# EAGLE design openSX70-dongle-USB-V2-1 (EAGLE 9.2.0)
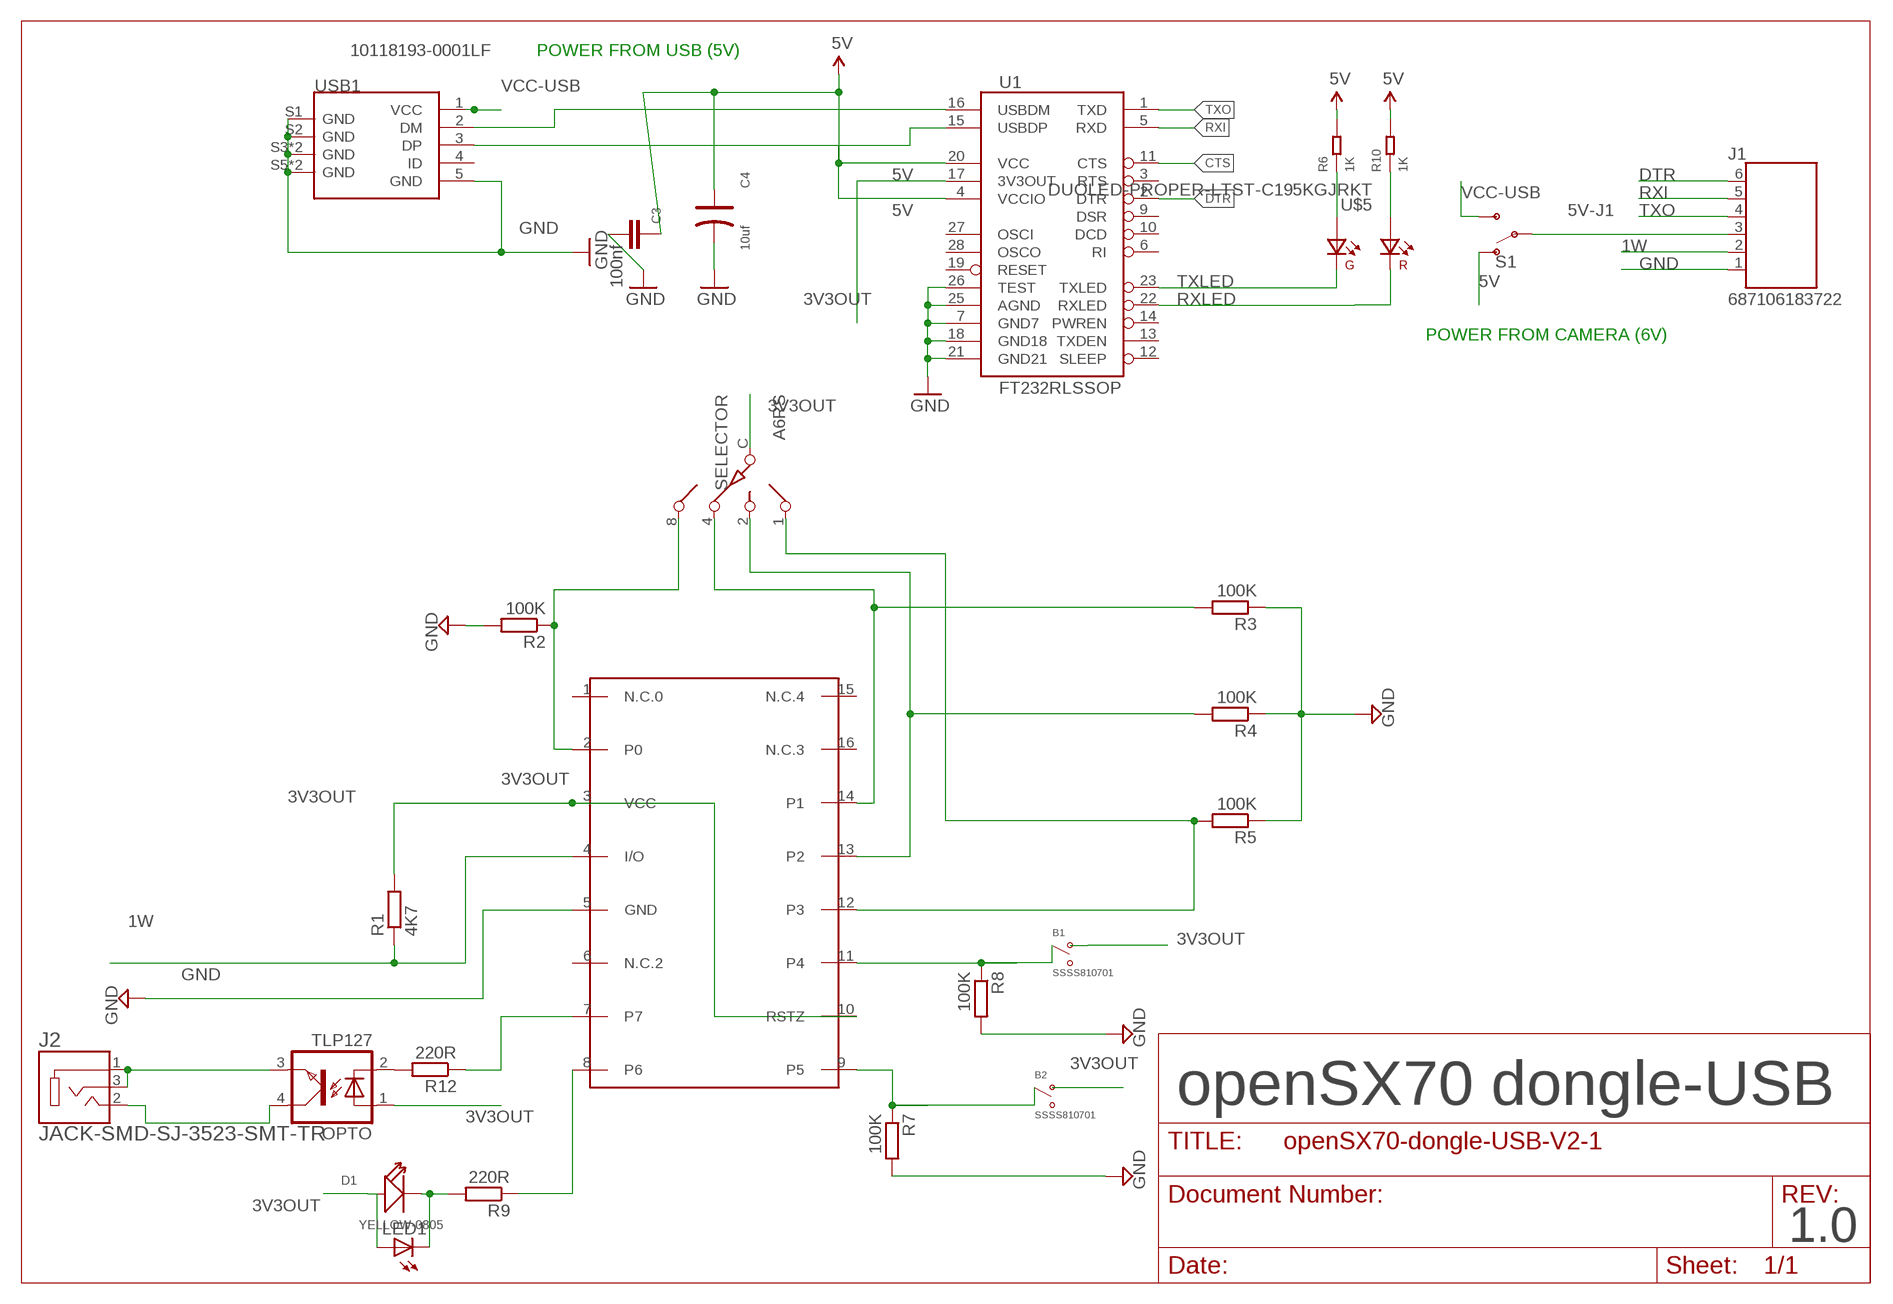
[diagram p0: schematic, sheet 1]

## Parts
B1  SSSS810701  [SSSS810701]
B2  SSSS810701  [SSSS810701]
C3  100nf  C-EUC0603  [C0603]
C4  10uf  TANTALUM-SMD-10UF-16V-10%(AVX-A)  [AVX-A]
D1  YELLOW-0805  SMD-LED-CLEAR-YELLOW(0805)  [LED-0805]
DS2408  DS2408  [SO16]
J1  687106183722  [687106183722]
J2  JACK-SMD-SJ-3523-SMT-TR  [CUI_SJ-3523-SMT-TR]
LED1  LED3MM  [LED3MM]
OPTO  TLP127  [SO-4]
R1  4K7  R-EU_R0603  [R0603]
R2  100K  R-EU_R0603  [R0603]
R3  100K  R-EU_R0603  [R0603]
R4  100K  R-EU_R0603  [R0603]
R5  100K  R-EU_R0603  [R0603]
R6  1K  SMD-RES-1K-1%-1/10W(0603)  [R0603]
R7  100K  R-EU_R0603  [R0603]
R8  100K  R-EU_R0603  [R0603]
R9  220R  R-EU_R0603  [R0603]
R10  1K  SMD-RES-1K-1%-1/10W(0603)  [R0603]
R12  220R  R-EU_R0603  [R0603]
S1  SWITCH-SPDT-SMD-RIGHT-ANGLE  [SWITCH_SPST_SMD_A]
SELECTOR  A6RS  [A6RS-161RS]
U1  FT232RLSSOP  [SSOP28DB]
U$5  DUOLED-PROPER-LTST-C195KGJRKT  [LTST-BILED-15X16]
USB1  10118193-0001LF  MICRO-USB-SMD-B-(10118193-0001LF)  [MICRO-USB5+6P-SMD-0.65-B]

## Nets
1W: DS2408.4(I/O) J1.2 R1.1
3V3OUT: B1.3(A) B2.3(A) D1.+ DS2408.3(VCC) DS2408.10(RSTZ) LED1.A OPTO.1(A) R1.2 SELECTOR.C U1.17(3V3OUT)
5V: C3.1 C4.+ R6.2 R10.2 S1.1(O) U1.4(VCCIO) U1.20(VCC)
5V-J1: J1.3 S1.2(P)
CTS: U1.11(CTS)
DTR: J1.6 U1.2(DTR)
GND: C3.2 C4.- DS2408.5(GND) J1.1 R2.2 R3.1 R4.1 R5.1 R7.2 R8.2 U1.7(GND7) U1.18(GND18) U1.21(GND21) U1.25(AGND) U1.26(TEST) USB1.5(GND) USB1.S1(GND) USB1.S2(GND) USB1.S3(GND) USB1.S4(GND) USB1.S5(GND) USB1.S6(GND)
N$1: J2.1 J2.3 OPTO.3(EMIT)
N$2: D1.- LED1.K(C) R9.2
N$3: DS2408.2(P0) R2.1 SELECTOR.8
N$4: DS2408.14(P1) R3.2 SELECTOR.4
N$5: DS2408.13(P2) R4.2 SELECTOR.2
N$6: B1.2(COM) DS2408.11(P4) R8.1
N$7: B2.2(COM) DS2408.9(P5) R7.1
N$8: DS2408.8(P6) R9.1
N$9: R10.1 U$5.P$2(A2)
N$10: OPTO.2(C) R12.2
N$11: DS2408.7 R12.1
N$12: J2.2 OPTO.4(COL)
N$13: DS2408.12(P3) R5.2 SELECTOR.1
N$14: R6.1 U$5.P$1(A1)
N$16: U1.16(USBDM) USB1.2(DM)
RXI: J1.5 U1.5(RXD)
RXLED: U1.22(RXLED) U$5.P$4(K2)
TXLED: U1.23(TXLED) U$5.P$3(K1)
TXO: J1.4 U1.1(TXD)
USB_D+: U1.15(USBDP) USB1.3(DP)
VCC-USB: S1.3(S) USB1.1(VCC)
Unconnected: B1.1(B) B2.1(B) DS2408.1(N.C.0) DS2408.6(N.C.2) DS2408.15(N.C.4) DS2408.16(N.C.3) U1.3(RTS) U1.6(RI) U1.9(DSR) U1.10(DCD) U1.12(SLEEP) U1.13(TXDEN) U1.14(PWREN) U1.19(RESET) U1.27(OSCI) U1.28(OSCO) USB1.4(ID)

## Notes on the sheet
- POWER FROM USB (5V)
- POWER FROM CAMERA (6V)
- openSX70 dongle-USB
- 1.0

## Library data of the parts
B1 B2 = _openSX70:SSSS810701; AVAILABILITY: Good; DESCRIPTION: Slide Switch • Rating (max.): 0.3 A 5 VDC • Poles: 1 • Positions: 2 • Travel : 1.5 mm • Operating direction: Horizontal; MF: ALPS; MP: SSSS810701; PACKAGE: None; PRICE: 0.53 USD
C3 = resistor:C-EU: CAPACITOR, European symbol
C4 = Seeed-Capacitor-2016:TANTALUM-SMD-10UF-16V-10%(AVX-A): 302020002; MPN: TAJA106K016RNJ
D1 = Seeed-LED-2016:SMD-LED-CLEAR-YELLOW(0805): 304090039; MPN: 17-215UYC/S530-A3/TR8
DS2408 = _openSX70:DS2408
J1 = openSX70_PATHFINDER_V5.5-SEEED_20180522:687106183722: 687106183722 WR-FPC 0.50mm SMT Horizontal Bottom Contact - Low Profile <http://katalog.we-online.de/media/images/v2/Family_WR-FPC_6871xx183722.jpg> Details see: http://katalog.we-online.de/en/em/FPC_0_5_SMT_ZIF_HORIZONTAL_BOTTOM_CONTACT_LOW_PROFILE_6871xx183722 Created by Yingchun,shan 2016 (C) Wurth Elektronik; AVAILABILITY: Good; DESCRIPTION: CONN FFC BTM 6POS 0.5MM SMD R/A; MF: Wurth Electronics; MP: 687106183722; PACKAGE: None; PRICE: 1.21 USD
J2 = _openSX70:JACK-SMD-SJ-3523-SMT-TR: Audio Jack Connector 3.5 mm Low Profile Surface Mount Stereo Jack, 3 Pin Right-Angle; AVAILABILITY: Unavailable; CUI_PURCHASE_URL: https://www.cui.com/product/interconnect/audio-connectors/3.5-mm-jacks/sj-352x-smt-series?utm_source=snapeda.com&utm_medium=referral&utm_campaign=snapedaBOM; DESCRIPTION: SJ Series 3.5 mm 12 V SMT Right Angle Stereo Audio Jack; MF: CUI Inc.; MP: SJ-3523-SMT-TR; PACKAGE: LGA-10 STMicroelectronics; PRICE: None
LED1 = openSX70_PATHFINDER_V5.5-SEEED_20180522:LED: LED OSRAM: - CHIPLED LG R971, LG N971, LY N971, LG Q971, LY Q971, LO R971, LY R971 LH N974, LH R974 LS Q976, LO Q976, LY Q976 LO Q996 - Hyper CHIPLED LW Q18S LB Q993, LB Q99A, LB R99A - SideLED LS A670, LO A670, LY A670, LG A670, LP A670 LB A673, LV A673, LT A673, LW A673 LH A674 LY A675 LS A676, LA A676, LO A676, LY A676, LW A676 LS A679, LY A679, LG A679 - Hyper Micro SIDELED® LS Y876, LA Y876, LO Y876, LY Y876 LT Y87S - SmartLED LW L88C, LW L88S LB L89C, LB L89S, LG L890 LS L89K, LO L89K, LY L89K LS L896, LA L896, LO L896, LY L896 - TOPLED LS T670, LO T670, LY T670, LG T670, LP T670 LSG T670, LSP T670, LSY T670, LOP T670, LYG T670 LG T671, LOG T671, LSG T671 LB T673, LV T673, LT T673, LW T673 LH T674 LS T676, LA T676, LO T676, LY T676, LB T676, LH T676, LSB T676, LW T676 LB T67C, LV T67C, LT T67C, LS T67K, LO T67K, LY T67K, LW E67C LS E67B, LA E67B, LO E67B, LY E67B, LB E67C, LV E67C, LT E67C LW T67C LS T679, LY T679, LG T679 LS T770, LO T770, LY T770, LG T770, LP T770 LB T773, LV T773, LT T773, LW T773 LH T774 LS E675, LA E675, LY E675, LS T675 LS T776, LA T776, LO T776, LY T776, LB T776 LHGB T686 LT T68C, LB T68C - Hyper Mini TOPLED® LB M676 - Mini TOPLED Santana® LG M470 LS M47K, LO M47K, LY M47K Source: http://www.osram.convergy.de LUXEON: - LUMILED® LXK2-PW12-R00, LXK2-PW12-S00, LXK2-PW14-U00, LXK2-PW14-V00 LXK2-PM12-R00, LXK2-PM12-S00, LXK2-PM14-U00 LXK2-PE12-Q00, LXK2-PE12-R00, LXK2-PE12-S00, LXK2-PE14-T00, LXK2-PE14-U00 LXK2-PB12-K00, LXK2-PB12-L00, LXK2-PB12-M00, LXK2-PB14-N00, LXK2-PB14-P00, LXK2-PB14-Q00 LXK2-PR12-L00, LXK2-PR12-M00, LXK2-PR14-Q00, LXK2-PR14-R00 LXK2-PD12-Q00, LXK2-PD12-R00, LXK2-PD12-S00 LXK2-PH12-R00, LXK2-PH12-S00 LXK2-PL12-P00, LXK2-PL12-Q00, LXK2-PL12-R00 Source: www.luxeon.com KINGBRIGHT: KA-3528ASYC Source: www.kingbright.com
OPTO = openSX70:TLP127
R1-R5 R7-R9 R12 = resistor:R-EU_: RESISTOR, European symbol
R6 R10 = openSX70_PATHFINDER_V5.5-SEEED_20180522:SMD-RES-1K-1%-1/10W(0603): 301010298; MPN: RC0603FR-071KL
S1 = SparkFun-Switches:SWITCH-SPDT: Single Pole, Double Throw (SPDT) Switch Single-pole, double-throw (SPDT) switch. Variant Overview SMD-AYZ0202 Surface Mount DPDT Switch <https://www.sparkfun.com/products/597> (COM-00597) Used on e.g. LilyPad Arduino USB - ATmega32U4 Board <https://www.sparkfun.com/products/12049> PTH-11.6X4.0MM SPDT Mini Power Switch <https://www.sparkfun.com/products/102> (COM-00102) Used on e.g. SparkFun Simon Says - Through-Hole Soldering Kit <https://www.sparkfun.com/products/10547> (KIT-10547) PTH-11.6X4.0MM-KIT KIT version of SPDT Mini Power Switch - Simplifies soldering by removing tStop of switch pins - only one side can be soldered. PTH-11.6X4.0MM-LOCK LOCK version of SPDT Mini Power Switch - Offset pins hold switch in place for easier soldering. SMD-RIGHT-ANGLE Surface Mount Right Angle Switch <https://www.sparkfun.com/products/10860> (COM-10860) Used on e.g. SparkFun ESP8266 Thing <https://www.sparkfun.com/products/13231>; PROD_ID: SWCH-10651; SF_SKU: COM-10860
SELECTOR = _openSX70:A6RS
U1 = SparkFun:FT232RL: USB UART FT232RL 4th Generation USB UART (USB <-> Serial) Controller. Spark Fun Electronics SKU : COM-00650
U$5 = _openSX70:DUOLED-PROPER-LTST-C195KGJRKT; AVAILABILITY: Unavailable; DESCRIPTION: Green/Red 130° Water Clear 35/25 mcd 2 V 0605 Surface Mount Bi-Color LED; MF: Lite-On Inc.; MP: LTST-C195KGJRKT; PACKAGE: 0606 Lite-On; PRICE: None
USB1 = Seeed-Connector -2016:MICRO-USB-SMD-B-(10118193-0001LF): 320010003; MPN: 10118193-0001LF

## Net classes
0 GND: width 0.203 mm
1 power: width 0.203 mm
2 2.8V: width 0.203 mm

## Board
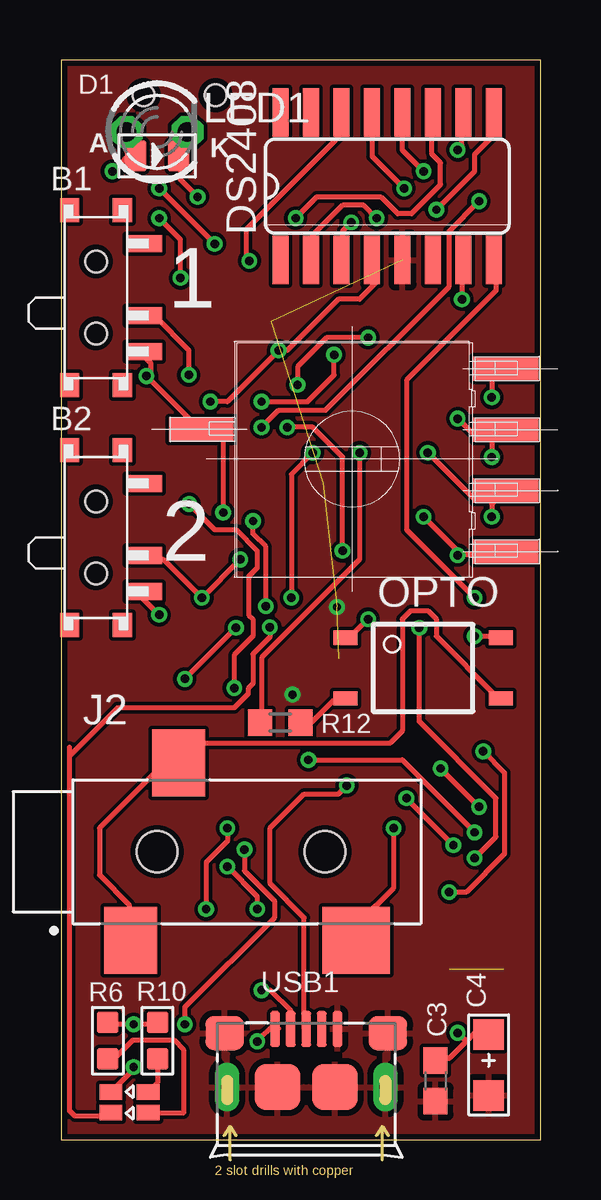
[diagram p1: board, top side]
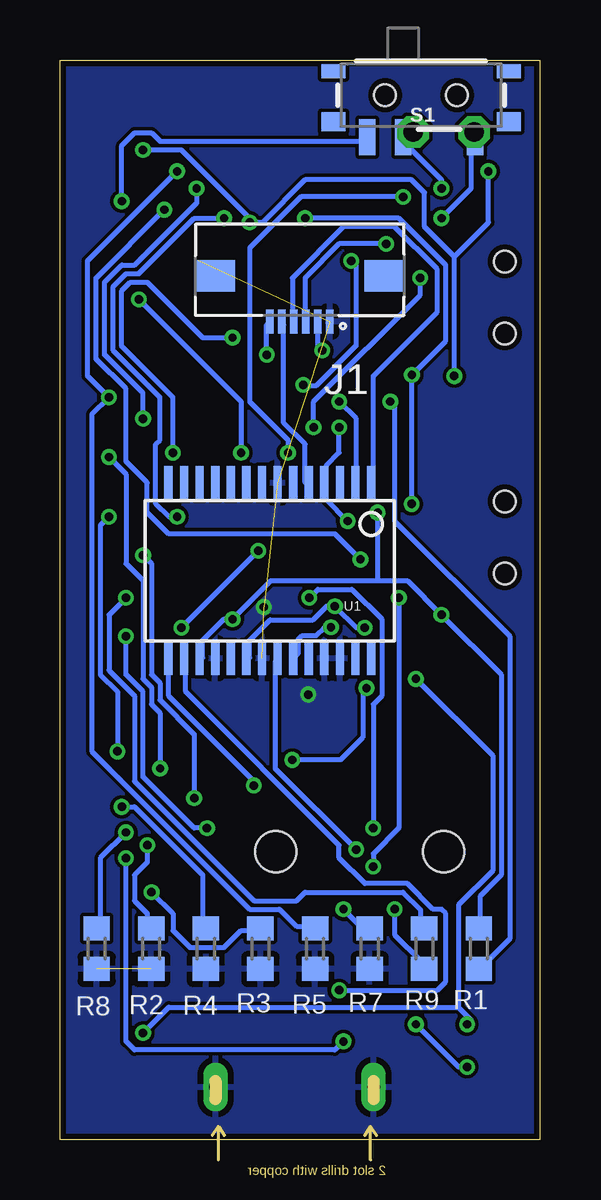
[diagram p2: board, bottom side, seen from below]

Size 20 x 45 mm. Coordinates in mm from the lower left corner, seen from the top.
Outline: 0,0 20,0 20,45 0,45 0,0
Copper layers (1*16): Top 0.035mm / dielectric 1.5mm / Bottom 0.035mm
Design rules "SeeedStudio_2layer_DRU_no_angle_20140221": minimum track width 6mil, minimum drill 12mil, track to track 6mil, track to pad 6mil, pad to pad 6mil, via to via 6mil, smd to smd 0mil, copper to edge 10mil, drill to drill 10mil, minimum pad ring 10mil, minimum via ring 6mil, stop-mask expansion 2mil, vias tented up to drill 100mil, thermal gap 10mil

### Footprints (pad centres in the part's own frame; a part is rotated, then mirrored left to right if it is on the bottom)
SSSS810701 = smd 0.7 x 1.5: 1 -2.25,2; 2 0.75,2; 3 2.25,2 | smd 1 x 0.8: 4.1 -3.65,1.1; 4.2 3.65,1.1; 4.3 -3.65,-1.1; 4.4 3.65,-1.1 | hole 0.9: 1.5,0; -1.5,0
C0603 = smd 1.1 x 1: 1 -0.85,0; 2 0.85,0
AVX-A = smd 1.27 x 1.27: + -1.27,0; - 1.27,0
LED-0805 = smd 0.889 x 1.27: + -0.889,0; - 0.889,0
SO16 = smd 0.66 x 2.032: 1 -4.445,-3.073; 2 -3.175,-3.073; 3 -1.905,-3.073; 4 -0.635,-3.073; 5 0.635,-3.073; 6 1.905,-3.073; 7 3.175,-3.073; 8 4.445,-3.073; 9 4.445,3.073; 10 3.175,3.073; 11 1.905,3.073; 12 0.635,3.073; 13 -0.635,3.073; 14 -1.905,3.073; 15 -3.175,3.073; 16 -4.445,3.073
687106183722 = smd 0.3 x 1: 1 -1.25,1.9; 2 -0.75,1.9; 3 -0.25,1.9; 4 0.25,1.9; 5 0.75,1.9; 6 1.25,1.9 | smd 1.65 x 1.3: Z1 -3.525,0; Z2 3.525,0
CUI_SJ-3523-SMT-TR = smd 2.2 x 2.8: 1 -1.1,-3.7; 3 0.9,3.7 | smd 2.8 x 2.8: 2 8.3,-3.7 | hole 1.7: 0,0; 7,0
LED3MM = drill 0.813 octagon: A -1.27,0; K 1.27,0
SO-4 = smd 1 x 0.6: 1 -3.24,0.635; 2 -3.24,-1.905; 3 3.24,-1.905; 4 3.24,0.635
R0603 = smd 1 x 1.1: 1 -0.85,0; 2 0.85,0
R0603' = smd 0.889 x 0.889: 1 0,0.762; 2 0,-0.762
SWITCH_SPST_SMD_A = smd 0.7 x 1.5: 1 -2.25,-1.75; 2 -0.75,-1.75; 3 2.25,-1.75 | smd 1 x 0.6: GND1 -3.65,1; GND3 3.65,1 | smd 1 x 0.8: GND2 -3.65,-1.1; GND4 3.65,-1.1 | hole 0.9: -1.5,0; 1.5,0
A6RS-161RS = smd 1 x 2.7: 1 8.89,-1.397; 2 6.35,-1.397; 4 3.81,-1.397; 8 1.27,-1.397; C 6.35,11.303
SSOP28DB = smd 0.348 x 1.397: 1 -4.225,-3.656; 2 -3.575,-3.656; 3 -2.925,-3.656; 4 -2.275,-3.656; 5 -1.625,-3.656; 6 -0.975,-3.656; 7 -0.325,-3.656; 8 0.325,-3.656; 9 0.975,-3.656; 10 1.625,-3.656; 11 2.275,-3.656; 12 2.925,-3.656; 13 3.575,-3.656; 14 4.225,-3.656; 15 4.225,3.656; 16 3.575,3.656; 17 2.925,3.656; 18 2.275,3.656; 19 1.625,3.656; 20 0.975,3.656; 21 0.325,3.656; 22 -0.325,3.656; 23 -0.975,3.656; 24 -1.625,3.656; 25 -2.275,3.656; 26 -2.925,3.656; 27 -3.575,3.656; 28 -4.225,3.656
LTST-BILED-15X16 = smd 0.65 x 0.952: P$1 0.425,0.776; P$2 -0.425,0.776; P$3 0.425,-0.776; P$4 -0.425,-0.776
MICRO-USB5+6P-SMD-0.65-B = smd 0.4 x 1.5: 1 -1.3,-0.25; 2 -0.65,-0.25; 3 0,-0.25; 4 0.65,-0.25; 5 1.3,-0.25 | smd 1.6 x 1.4: S1 -3.4,-0.427; S6 3.4,-0.427 | drill 0.508 pad 1.016 long: S2 -3.3,-2.675; S5 3.3,-2.675 | smd 1.9 x 1.9: S3 -1.2,-2.675; S4 1.2,-2.675

### Placement (x,y rotation side)
B1  1.45,35.1 270 top
B2  1.45,25.1 270 top
C3  15.61,2.45 270 top
C4  17.83,3.11 270 top
D1  4,41 0 top
DS2408  13.6,39.74 0 top
J1  10,36 180 bottom
J2  4,12 0 top
LED1  4,42 0 top
OPTO  15.09,20.29 0 top
R1  2.53,7.96 90 bottom
R2  16.19,7.96 270 bottom
R3  11.64,7.96 90 bottom
R4  13.92,7.96 90 bottom
R5  9.36,7.96 90 bottom
R6  1K  [R0603']  1.94,4.12 180 top
R7  7.08,7.96 270 bottom
R8  18.47,7.96 270 bottom
R9  4.81,7.96 270 bottom
R10  1K  [R0603']  4.02,4.12 180 top
R12  9.14,17.38 0 top
S1  4.94,43.53 0 bottom
SELECTOR  17.15,23.24 90 top
U1  11.25,23.71 180 bottom
U$5  2.85,1.55 270 top
USB1  10.22,4.86 0 top

### Tracks (layer width: path | path; a pad name or v marks a point on that pad's centre or on a via)
1W  (via drill 0.35)
  Top 0.203: DS2408.4 12.98,36.63 13.16,36.45 13.16,35.74 12.45,35.03 11.56,35.03 9.42,32.89 v9.07,32.89 6.93,30.76 v6.22,30.76
  Bottom 0.203: v9.07,32.89 9.25,33.07 9.25,33.96 J1.2 | v6.22,30.76 6.04,30.58 6.04,25.78 1.25,20.98 1.25,8.36 2.49,7.11 R1.1
3V3OUT  (via drill 0.35)
  Top 0.203: v12.8,21.69 12.09,20.98 11.91,20.98 OPTO.1 | v4.09,21.87 3.38,22.58 3.38,22.76 B2.3 | 3.02,40.89 2.67,40.89 v2.13,40.36 | 3.02,40.89 D1.+ | v12.09,38.23 11.73,37.87 11.73,36.8 DS2408.3 | v16.54,41.25 16.71,41.43 16.71,42.67 DS2408.10 | v6.76,26.14 6.76,29.16 6.4,29.52 5.87,29.52 SELECTOR.C 5.69,29.69 v3.56,31.83 3.73,32 3.73,32.36 3.38,32.72 B1.3 | LED1.A 2.73,41.19 3.02,40.89
  Bottom 0.203: U1.17 14.05,20.09 14.05,20.8 13.16,21.69 v12.8,21.69 11.2,23.29 6.76,23.29 | 6.76,23.29 5.51,23.29 v4.09,21.87 1.6,19.38 1.6,11.02 2.49,10.13 2.49,8.89 R1.2 | v2.13,40.36 2.13,38.23 3.56,36.8 | v3.56,31.83 3.56,36.8 | 11.91,38.23 11.56,38.23 9.78,40.01 5.33,40.01 4.8,39.47 4.8,38.05 3.56,36.8 | v16.54,41.25 14.94,41.25 11.91,38.23 | 11.91,38.23 v12.09,38.23 | v6.76,26.14 6.76,23.29
5V  (via drill 0.35)
  Top 0.203: R6.2 1.96,4.8 v3.02,4.8 3.91,4.8 R10.2 | 16.89,4.09 17.25,4.45 17.78,4.45 C4.+ | 16.89,4.09 16.18,3.38 15.65,3.38 C3.1 | 16.89,4.09 v16.54,4.45 | v8,25.78 8,25.25 8.53,24.71 v8.53,22.23 | v17.42,39.12 16.18,37.87 16.18,35.56 11.02,30.4 9.07,30.4 v8.36,29.69 | v7.29,21.34 v5.16,19.2
  Bottom 0.203: v3.02,4.8 2.85,4.8 2.85,4.98 3.38,5.51 | 3.38,5.51 15.47,5.51 v16.54,4.45 | v8,25.78 8.89,26.67 8.89,27.2 U1.4 8.89,27.38 8.89,28.09 8.36,28.63 v8.36,29.69 | U1.20 12.09,20.09 12.09,20.8 11.23,21.66 9.46,21.66 8.89,22.23 v8.53,22.23 7.64,21.34 v7.29,21.34 | v17.42,39.12 17.42,41.43 16.89,41.96 16.18,41.96 15.82,41.6 7.29,41.6 S1.1 | 3.38,5.51 3.38,9.78 1.96,11.2 1.96,16 v5.16,19.2
5V-J1  (via drill 0.35)
  Top 0.203: v4.09,39.65 v6.4,37.34
  Bottom 0.203: v6.4,37.34 8.36,37.34 9.78,35.92 9.78,34.14 J1.3 | v4.09,39.65 4.09,40.01 5.69,41.6 S1.2
DTR  (via drill 0.35)
  Top 0.203: v11.38,32.72 11.38,31.86 10.27,30.76 v8.36,30.76
  Bottom 0.203: v11.38,32.72 11.38,33.96 J1.6 | v8.36,30.76 7.64,30.05 7.64,27.38 U1.2
GND  (via drill 0.35)  (5 unrouted)
  other vias: 9.65,18.55 11.5,22.2
  pour Top: 0,45 20,45 20,0 0,0
  pour Bottom: 0,45 20,45 20,0 0,0
N$1
  Top 0.203: OPTO.3 18.31,18.49 18.14,18.49 15.65,20.98 15.65,21.69 15.29,22.05 14.58,22.05 14.23,21.7 14.23,17.03 13.73,16.54 5.69,16.54 4.98,15.82 J2.3 4.8,15.65 4.27,15.65 1.6,12.98 1.6,11.02 2.85,9.78 2.85,8.36 J2.1
N$2  (via drill 0.35)
  Top 0.203: v6.04,9.6 6.04,11.56 6.93,12.45 v6.93,12.98 | v9.6,22.58 9.6,27.74 v10.49,28.63 | v5.69,39.29 4.98,40.01 4.98,40.89 D1.- 5.27,41.38 LED1.K
  Bottom 0.203: v6.04,9.6 6.04,8.53 4.98,7.47 4.98,7.11 R9.2 | v6.93,12.98 6.93,18.14 6.58,18.49 6.58,21.69 7.82,22.94 9.25,22.94 v9.6,22.58 | v10.49,28.63 10.49,29.16 12.09,30.76 12.09,37.16 9.96,39.29 v5.69,39.29
N$3  (via drill 0.35)
  Top 0.203: v14.4,14.22 v16.36,12.27 | 16.71,24.36 18.49,24.36 SELECTOR.8 | v13.16,38.41 12.62,38.94 11.73,38.94 10.49,37.69 10.49,36.8 DS2408.2 | 16.71,24.36 v15.11,25.96 | 16.71,24.36 v16.54,24.36
  Bottom 0.203: v16.36,12.27 16.36,11.56 16.89,11.02 16.89,9.96 16.36,9.42 16.36,8.89 R2.1 | v14.4,14.22 14.4,16.89 15.82,18.31 15.82,19.02 16.18,19.38 16.18,24 v16.54,24.36 | v13.16,38.41 14.4,38.41 16.71,36.09 17.25,36.09 17.78,35.56 17.78,32.89 15.82,30.94 15.82,29.16 16,28.98 16,26.49 15.47,25.96 v15.11,25.96
N$4  (via drill 0.35)
  Top 0.203: v16.18,10.31 16.89,10.31 18.49,11.91 18.49,15.29 v17.6,16.18 | v17.96,25.96 17.96,26.49 18.14,26.67 | 18.14,26.67 18.49,27.03 SELECTOR.4 18.14,26.67 | v7.85,36.63 7.7,36.78 7.7,37.93 11.56,41.78 11.56,42.67 DS2408.14 | v9.86,31.46 9.86,32.21 11.07,33.43 v12.8,33.43 | v15.29,28.63 17.25,26.67 18.14,26.67
  Bottom 0.203: v16.18,10.31 15.29,9.42 15.29,8.71 14.58,8 13.16,8 12.45,8.71 11.73,8.71 R3.2 | v17.6,16.18 17.6,18.67 18.31,19.38 18.31,25.6 v17.96,25.96 | v7.85,36.63 7.65,36.43 7.65,33.09 9.31,31.43 9.83,31.43 v9.86,31.46 | v12.8,33.43 14.05,33.43 16.36,35.74 17.07,35.74 17.42,35.38 17.42,33.07 15.29,30.94 v15.29,28.63
N$5  (via drill 0.35)
  Top 0.203: v15.82,15.47 v17.42,13.87 | v17.96,28.45 17.96,29.16 18.14,29.34 | 18.14,29.34 18.49,29.69 SELECTOR.2 18.14,29.34 | v14.3,39.65 12.98,40.97 12.98,42.67 DS2408.13 | v16.54,30.05 17.25,29.34 18.14,29.34
  Bottom 0.203: v17.42,13.87 16.89,13.87 14.05,11.02 14.05,8.89 R4.2 | v15.82,15.47 15.82,17.78 16.18,18.14 16.18,18.85 16.54,19.2 16.54,23.29 17.25,24 17.25,27.74 v17.96,28.45 | v14.3,39.65 14.3,39.04 16.89,36.45 17.42,36.45 18.14,35.74 18.14,32.72 16.54,31.11 v16.54,30.05
N$6  (via drill 0.35)
  Top 0.203: v17.25,12.8 14.22,15.82 v10.31,15.82 | v7.22,18.82 7.22,20.2 8,20.98 8,21.69 7.82,21.87 7.82,23.47 8.18,23.82 8.18,24.54 7.29,25.43 6.4,25.43 v5.33,26.49 | v5.32,31.87 5.32,32.9 3.91,34.31 3.56,34.31 | 3.38,34.31 3.56,34.31 | v9.78,38.41 10.67,39.29 13.34,39.29 14.04,38.59 14.61,38.59 15.82,39.8 15.82,40.72 15.47,41.07 15.47,42.67 DS2408.11 | 3.56,34.31 B1.2
  Bottom 0.203: v17.25,12.8 18.31,11.73 18.31,8.89 R8.1 | v7.22,18.82 7.37,18.67 7.37,16.77 8.31,15.82 v10.31,15.82 | v5.33,26.49 5.33,31.86 v5.32,31.87 3.91,33.28 3.91,36.45 5.87,38.41 v9.78,38.41
N$7  (via drill 0.35)
  Top 0.203: v8.18,9.6 8.18,10.13 v6.93,11.38 | 3.38,24.18 3.56,24.18 | 3.56,24.18 4.27,24.18 v5.87,22.58 v7.47,24.18 | v15.65,38.76 17.25,40.36 17.25,41.07 17.96,41.78 17.96,42.67 DS2408.9 | 3.56,24.18 B2.2
  Bottom 0.203: v8.18,9.6 7.47,8.89 7.11,8.89 R7.1 | v6.93,11.38 6.93,11.91 5.87,12.98 v5.87,22.58 | v15.65,38.76 18.49,35.92 18.49,32.54 17.25,31.29 17.25,28.27 16.36,27.38 16.36,26.14 15.47,25.25 8.53,25.25 v7.47,24.18
N$8  (via drill 0.35)
  Top 0.203: v17.25,22.58 14.4,25.43 14.4,31.65 18.14,35.38 18.14,36.63 DS2408.8
  Bottom 0.203: v17.25,22.58 17.96,21.87 17.96,19.56 16.89,18.49 16.89,14.94 11.91,9.96 10.13,9.96 9.78,10.31 5.69,10.31 4.98,9.6 4.98,8.89 R9.1
N$9
  Top 0.203: R10.1 4.02,2.37 U$5.P$2
N$10
  Top 0.203: OPTO.2 11.73,18.31 11.38,18.31 10.49,17.42 10.03,17.42 R12.2
N$11  (via drill 0.35)
  Top 0.203: v12.45,28.63 12.45,24.18 8.36,20.09 8.36,17.48 R12.1 | v16.71,35.03 16.71,36.63 DS2408.7
  Bottom 0.203: v12.45,28.63 12.45,30.76 v16.71,35.03
N$12  (via drill 0.35)
  Top 0.203: v17.25,20.98 18.31,20.98 OPTO.4 | v13.87,12.98 13.87,10.49 12.45,9.07 12.45,8.36 J2.2
  Bottom 0.203: v17.25,20.98 17.25,19.38 16.54,18.67 16.54,15.11 14.4,12.98 v13.87,12.98
N$13  (via drill 0.35)
  Top 0.203: v17.96,30.94 17.96,31.65 18.49,32.18 SELECTOR.1 | v15.11,40.36 14.22,41.25 14.22,42.67 DS2408.12
  Bottom 0.203: R5.2 9.42,8.89 10.13,8.89 10.85,9.6 12.09,9.6 18.67,16.18 18.67,30.23 v17.96,30.94 18.85,31.83 18.85,36.63 v15.11,40.36
N$14
  Top 0.203: R6.1 2.21,3.36 3,4.15 4.7,4.15 5.1,3.75 5.1,1.1 3.65,1.1 U$5.P$1
N$16  (via drill 0.35)
  Top 0.203: v8.36,6.22 8.71,6.22 9.6,5.33 9.6,4.62 USB1.2
  Bottom 0.203: v8.36,6.22 4.27,6.22 3.91,6.58 3.91,9.42 4.09,9.6 4.45,9.6 5.51,10.67 7.29,10.67 8.36,11.73 8.36,12.27 14.76,18.67 14.76,19.91 U1.16
RXI
  Bottom 0.203: J1.5 10.67,33.96 10.67,29.87 9.78,28.98 9.78,27.38 U1.5
RXLED  (via drill 0.35)
  Top 0.203: v5.16,4.8 5.16,5.51 8.89,9.25 8.89,9.96 7.64,11.2 v7.64,12.09 | v3.02,3.02 3.02,2.92 U$5.P$4
  Bottom 0.203: v3.02,3.02 3.38,3.02 v5.16,4.8 | v7.64,12.09 11.02,15.47 11.02,19.91 U1.22
TXLED  (via drill 0.35)
  Top 0.203: 0.36,16 0.36,1.19 0.57,0.97 1.92,0.97 U$5.P$3 | 0.36,16 0.36,16.36 | v8.7,21.35 8.7,20.94 8,20.24 8,19 7.8,18.8 7.8,18.58 7.22,18 2.36,18 0.36,16
  Bottom 0.203: U1.23 10.05,20.28 10.05,20.86 9.9,21.01 9.32,21.01 8.98,21.35 v8.7,21.35
TXO
  Bottom 0.203: J1.4 10.31,34.14 10.31,35.92 8.18,38.05 6.04,38.05 4.27,36.27 4.27,34.49 6.93,31.83 6.93,27.38 U1.1
USB_D+  (via drill 0.35)
  Top 0.203: v11.91,14.76 11.56,14.4 10.13,14.4 8.71,12.98 8.71,10.67 10.13,9.25 10.13,4.62 USB1.3
  Bottom 0.203: v11.91,14.76 11.91,14.94 15.47,18.49 15.47,19.91 U1.15
VCC-USB  (via drill 0.35)
  Top 0.203: v4.09,38.41 4.98,37.52 v4.98,35.92 | v9.42,29.69 10.49,29.69 11.73,28.45 v11.73,24.54 | v14.94,21.34 14.94,17.42 18.14,14.22 18.14,12.62 v17.25,11.73 | v8.18,4.09 8.89,4.8 9.07,4.62 USB1.1
  Bottom 0.203: v4.09,38.41 2.85,39.65 2.85,41.6 S1.3 | v4.98,35.92 4.98,35.2 9.42,30.76 v9.42,29.69 | v14.94,21.34 v11.73,24.54 | v17.25,11.73 17.25,4.09 16.89,3.73 8.53,3.73 v8.18,4.09

### Text on the board
tPlace: 1 | 2
tNames: A | K